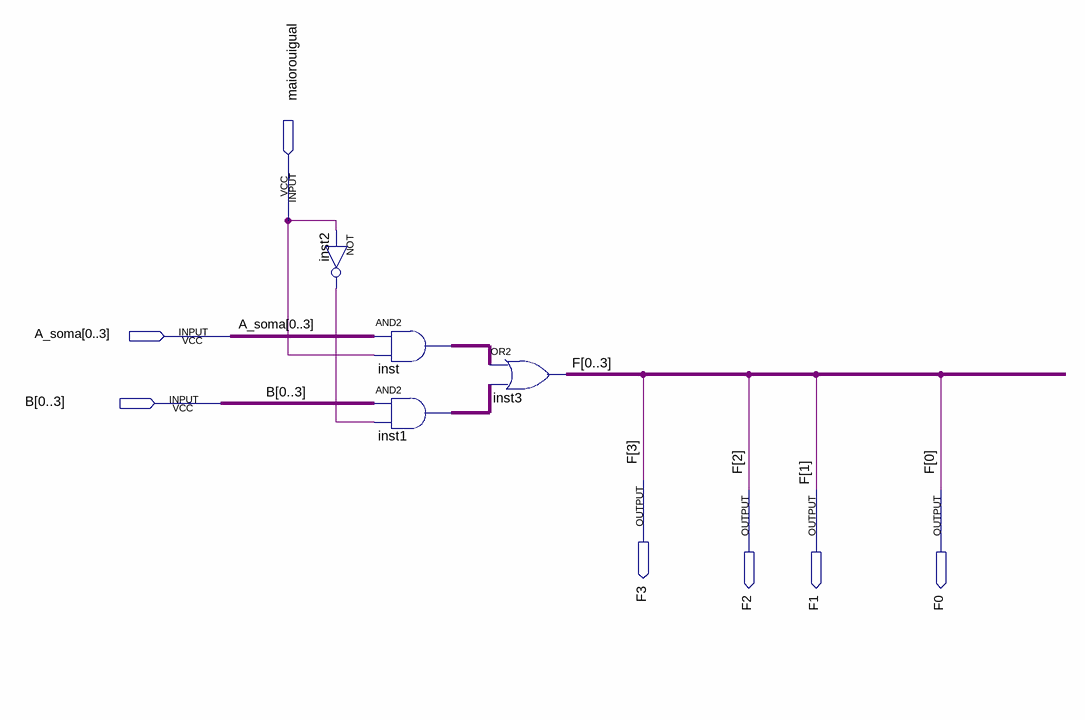
[diagram p0: schematic sheet]
// Quartus schematic MUX_5.bdf as structural Verilog: 4 symbols, 7 pins
module MUX_5 (
  input  maiorouigual,
  input  [0:3] A_soma,
  input  [0:3] B,
  output F3,
  output F2,
  output F1,
  output F0
);

  wire inst2_out;
  wire [3:0] inst1_out, inst_out;

  not inst2 (inst2_out, maiorouigual);
  assign inst_out = A_soma & {4{maiorouigual}};  // AND2 inst, 4 bits wide
  assign inst1_out = B & {4{inst2_out}};  // AND2 inst1, 4 bits wide
  assign {F0, F1, F2, F3} = inst_out | inst1_out;  // OR2 inst3, 4 bits wide
endmodule
